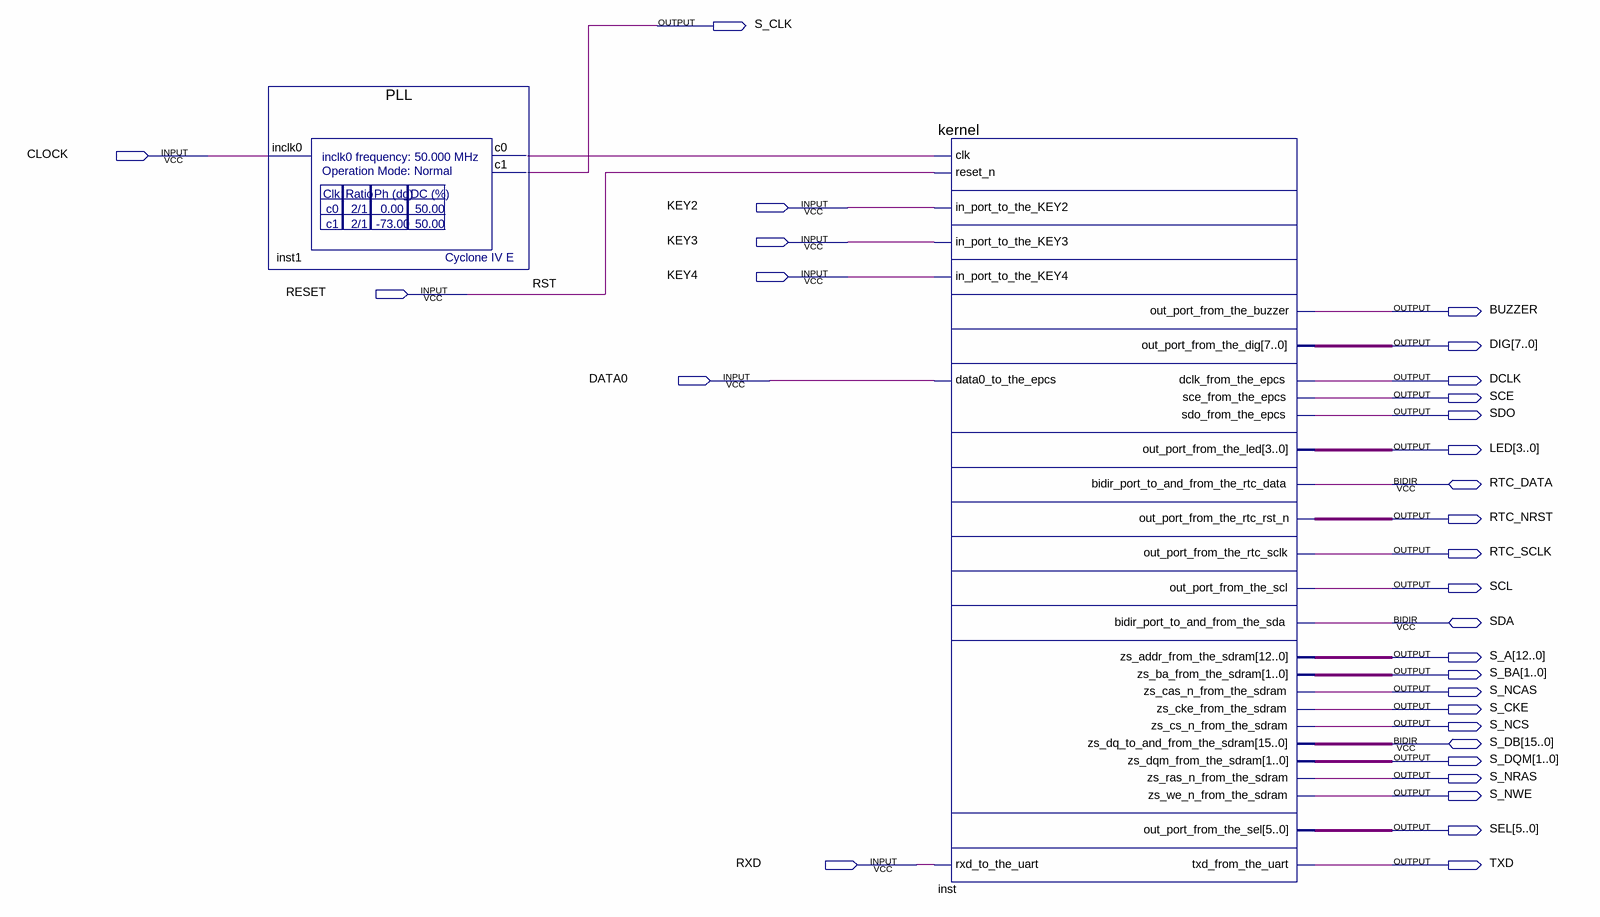
[diagram p0: schematic sheet]
// Quartus schematic HELLO.bdf as structural Verilog: 2 symbols, 30 pins
module HELLO (
  input  CLOCK,
  input  KEY2,
  input  KEY3,
  input  KEY4,
  input  RESET,
  input  DATA0,
  input  RXD,
  inout  RTC_DATA,
  inout  SDA,
  inout  [15:0] S_DB,
  output S_CLK,
  output BUZZER,
  output [7:0] DIG,
  output DCLK,
  output SCE,
  output SDO,
  output [3:0] LED,
  output RTC_NRST,
  output RTC_SCLK,
  output SCL,
  output [12:0] S_A,
  output [1:0] S_BA,
  output S_NCAS,
  output S_CKE,
  output S_NCS,
  output [1:0] S_DQM,
  output S_NRAS,
  output S_NWE,
  output [5:0] SEL,
  output TXD
);

  wire inst1_c0;

  PLL inst1 (.inclk0(CLOCK), .c0(inst1_c0), .c1(S_CLK));
  kernel inst (
    .clk(inst1_c0), .reset_n(RESET), .in_port_to_the_KEY2(KEY2), .in_port_to_the_KEY3(KEY3),
    .in_port_to_the_KEY4(KEY4), .data0_to_the_epcs(DATA0), .rxd_to_the_uart(RXD),
    .out_port_from_the_buzzer(BUZZER), .out_port_from_the_dig(DIG), .dclk_from_the_epcs(DCLK),
    .sce_from_the_epcs(SCE), .sdo_from_the_epcs(SDO), .out_port_from_the_led(LED),
    .out_port_from_the_rtc_rst_n(RTC_NRST), .out_port_from_the_rtc_sclk(RTC_SCLK),
    .out_port_from_the_scl(SCL), .zs_addr_from_the_sdram(S_A), .zs_ba_from_the_sdram(S_BA),
    .zs_cas_n_from_the_sdram(S_NCAS), .zs_cke_from_the_sdram(S_CKE), .zs_cs_n_from_the_sdram(S_NCS),
    .zs_dqm_from_the_sdram(S_DQM), .zs_ras_n_from_the_sdram(S_NRAS), .zs_we_n_from_the_sdram(S_NWE),
    .out_port_from_the_sel(SEL), .txd_from_the_uart(TXD), .bidir_port_to_and_from_the_rtc_data(RTC_DATA),
    .bidir_port_to_and_from_the_sda(SDA), .zs_dq_to_and_from_the_sdram(S_DB));

  // Other names for the same wires on the sheet: RST = RESET
endmodule
